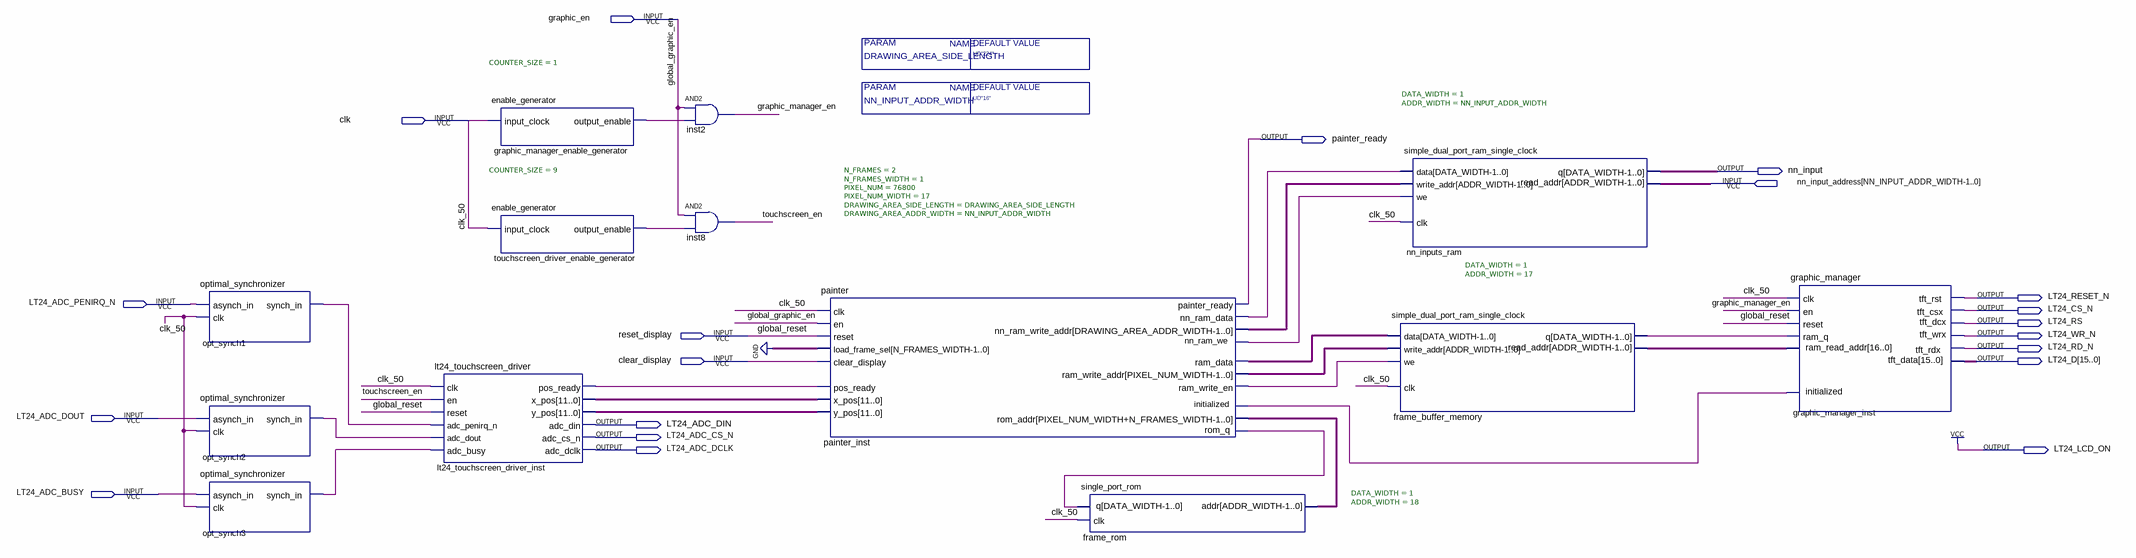
[diagram p0: schematic sheet]
// Quartus schematic graphic.bdf as structural Verilog: 13 symbols, 20 pins
module graphic #(parameter DRAWING_AREA_SIDE_LENGTH = "UD\"224\"", parameter NN_INPUT_ADDR_WIDTH = "UD\"16\"") (
  input  graphic_en,
  input  clk,
  input  \nn_input_address[NN_INPUT_ADDR_WIDTH-1..0] ,
  input  LT24_ADC_PENIRQ_N,
  input  reset_display,
  input  clear_display,
  input  LT24_ADC_DOUT,
  input  LT24_ADC_BUSY,
  output painter_ready,
  output nn_input,
  output LT24_RESET_N,
  output LT24_CS_N,
  output LT24_RS,
  output LT24_WR_N,
  output LT24_RD_N,
  output [15:0] LT24_D,
  output LT24_ADC_DIN,
  output LT24_ADC_CS_N,
  output LT24_ADC_DCLK,
  output LT24_LCD_ON
);

  wire frame_buffer_memory_q, frame_rom_q, graphic_manager_en,
       graphic_manager_enable_generator_output_enable, graphic_manager_inst_initialized,
       lt24_touchscreen_driver_inst_pos_ready, opt_synch1_synch_in, opt_synch2_synch_in, opt_synch3_synch_in,
       painter_inst_nn_ram_data, painter_inst_nn_ram_we, painter_inst_nn_ram_write_addr,
       painter_inst_ram_data, painter_inst_ram_write_en, touchscreen_driver_enable_generator_output_enable,
       touchscreen_en;
  wire [11:0] lt24_touchscreen_driver_inst_x_pos, lt24_touchscreen_driver_inst_y_pos;
  wire [16:0] graphic_manager_inst_ram_read_addr, painter_inst_ram_write_addr;
  wire [17:0] painter_inst_rom_addr;

  optimal_synchronizer opt_synch1 (.asynch_in(LT24_ADC_PENIRQ_N), .clk(clk), .synch_in(opt_synch1_synch_in));
  optimal_synchronizer opt_synch2 (.asynch_in(LT24_ADC_DOUT), .clk(clk), .synch_in(opt_synch2_synch_in));
  optimal_synchronizer opt_synch3 (.asynch_in(LT24_ADC_BUSY), .clk(clk), .synch_in(opt_synch3_synch_in));
  lt24_touchscreen_driver lt24_touchscreen_driver_inst (
    .clk(clk), .en(touchscreen_en), .reset(reset_display), .adc_penirq_n(opt_synch1_synch_in),
    .adc_dout(opt_synch2_synch_in), .adc_busy(opt_synch3_synch_in),
    .pos_ready(lt24_touchscreen_driver_inst_pos_ready), .x_pos(lt24_touchscreen_driver_inst_x_pos),
    .y_pos(lt24_touchscreen_driver_inst_y_pos), .adc_din(LT24_ADC_DIN), .adc_cs_n(LT24_ADC_CS_N),
    .adc_dclk(LT24_ADC_DCLK));
  enable_generator #(.COUNTER_SIZE(1)) graphic_manager_enable_generator (
    .input_clock(clk), .output_enable(graphic_manager_enable_generator_output_enable));
  enable_generator #(.COUNTER_SIZE(9)) touchscreen_driver_enable_generator (
    .input_clock(clk), .output_enable(touchscreen_driver_enable_generator_output_enable));
  and inst2 (graphic_manager_en, graphic_en, graphic_manager_enable_generator_output_enable);
  and inst8 (touchscreen_en, graphic_en, touchscreen_driver_enable_generator_output_enable);
  painter #(.N_FRAMES(2), .N_FRAMES_WIDTH(1), .PIXEL_NUM(76800), .PIXEL_NUM_WIDTH(17), .DRAWING_AREA_SIDE_LENGTH(DRAWING_AREA_SIDE_LENGTH), .DRAWING_AREA_ADDR_WIDTH(NN_INPUT_ADDR_WIDTH)) painter_inst (
    .clk(clk), .en(graphic_en), .reset(reset_display), .load_frame_sel(1'b0), .rom_q(frame_rom_q),
    .initialized(graphic_manager_inst_initialized), .pos_ready(lt24_touchscreen_driver_inst_pos_ready),
    .x_pos(lt24_touchscreen_driver_inst_x_pos), .y_pos(lt24_touchscreen_driver_inst_y_pos),
    .clear_display(clear_display), .rom_addr(painter_inst_rom_addr), .ram_data(painter_inst_ram_data),
    .ram_write_addr(painter_inst_ram_write_addr), .ram_write_en(painter_inst_ram_write_en),
    .nn_ram_data(painter_inst_nn_ram_data), .nn_ram_write_addr(painter_inst_nn_ram_write_addr),
    .nn_ram_we(painter_inst_nn_ram_we), .painter_ready(painter_ready));
  single_port_rom #(.DATA_WIDTH(1), .ADDR_WIDTH(18)) frame_rom (
    .addr(painter_inst_rom_addr), .clk(clk), .q(frame_rom_q));
  simple_dual_port_ram_single_clock #(.DATA_WIDTH(1), .ADDR_WIDTH(NN_INPUT_ADDR_WIDTH)) nn_inputs_ram (
    .data(painter_inst_nn_ram_data), .read_addr(\nn_input_address[NN_INPUT_ADDR_WIDTH-1..0] ),
    .write_addr(painter_inst_nn_ram_write_addr), .we(painter_inst_nn_ram_we), .clk(clk), .q(nn_input));
  simple_dual_port_ram_single_clock #(.DATA_WIDTH(1), .ADDR_WIDTH(17)) frame_buffer_memory (
    .data(painter_inst_ram_data), .read_addr(graphic_manager_inst_ram_read_addr),
    .write_addr(painter_inst_ram_write_addr), .we(painter_inst_ram_write_en), .clk(clk),
    .q(frame_buffer_memory_q));
  graphic_manager graphic_manager_inst (
    .clk(clk), .en(graphic_manager_en), .reset(reset_display), .ram_q(frame_buffer_memory_q),
    .tft_rst(LT24_RESET_N), .tft_csx(LT24_CS_N), .tft_dcx(LT24_RS),
    .ram_read_addr(graphic_manager_inst_ram_read_addr), .tft_wrx(LT24_WR_N),
    .initialized(graphic_manager_inst_initialized), .tft_rdx(LT24_RD_N), .tft_data(LT24_D));

  assign LT24_LCD_ON = 1'b1;

  // Other names for the same wires on the sheet: clk_50 = clk; global_graphic_en = graphic_en;
  //   global_reset = reset_display
endmodule
